# Altium schematic sheet TOP.SchDoc
size A; SheetNumber: 1; SheetTotal: 7
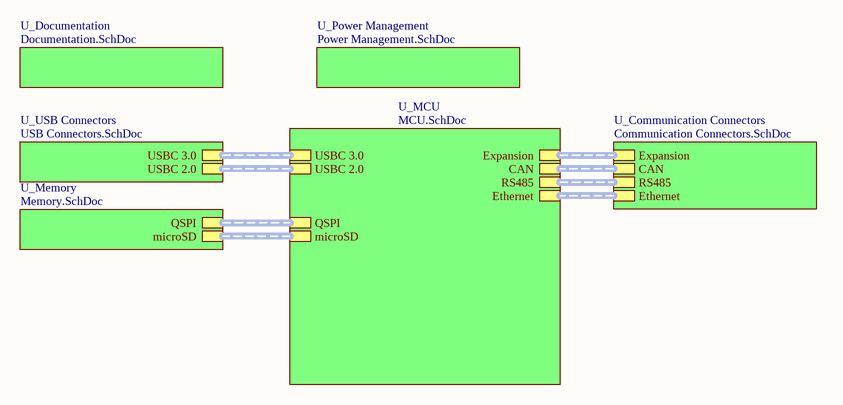
[diagram p0: TOP.SchDoc]

## Sub-sheets
U_Communication Connectors = Communication Connectors.SchDoc: Expansion (harness Expansion), CAN (harness CAN), RS485 (harness RS485), Ethernet (harness ETH)
U_Documentation = Documentation.SchDoc: no entries
U_MCU = MCU.SchDoc: USBC 3.0 (harness USB3.0+PD), USBC 2.0 (harness USB_PD_FS), Ethernet (harness ETH), QSPI (harness QSPI), CAN (harness CAN), RS485 (harness RS485), microSD (harness microSD), Expansion (harness Expansion)
U_Memory = Memory.SchDoc: QSPI (harness QSPI), microSD (harness microSD)
U_Power Management = Power Management.SchDoc: no entries
U_USB Connectors = USB Connectors.SchDoc: USBC 3.0 (harness USB3.0+PD), USBC 2.0 (harness USB_PD_FS)

## Buses and harness runs
harness sheet U_Communication Connectors/CAN = sheet U_MCU/CAN
harness sheet U_Communication Connectors/Ethernet = sheet U_MCU/Ethernet
harness sheet U_Communication Connectors/Expansion = sheet U_MCU/Expansion
harness sheet U_Communication Connectors/RS485 = sheet U_MCU/RS485
harness sheet U_MCU/microSD = sheet U_Memory/microSD
harness sheet U_MCU/QSPI = sheet U_Memory/QSPI
harness sheet U_MCU/USBC 2.0 = sheet U_USB Connectors/USBC 2.0
harness sheet U_MCU/USBC 3.0 = sheet U_USB Connectors/USBC 3.0